# Altium schematic sheet LT8316.SchDoc: LT8316
size A4; Author: Gurubaani; Organization: Waterloop; Address1: 200 University Ave W; Address2: Engineering 5, 1104; Address3: Waterloo, ON; Address4: N2L 3G1; Revision: C; SheetNumber: 3; SheetTotal: 4
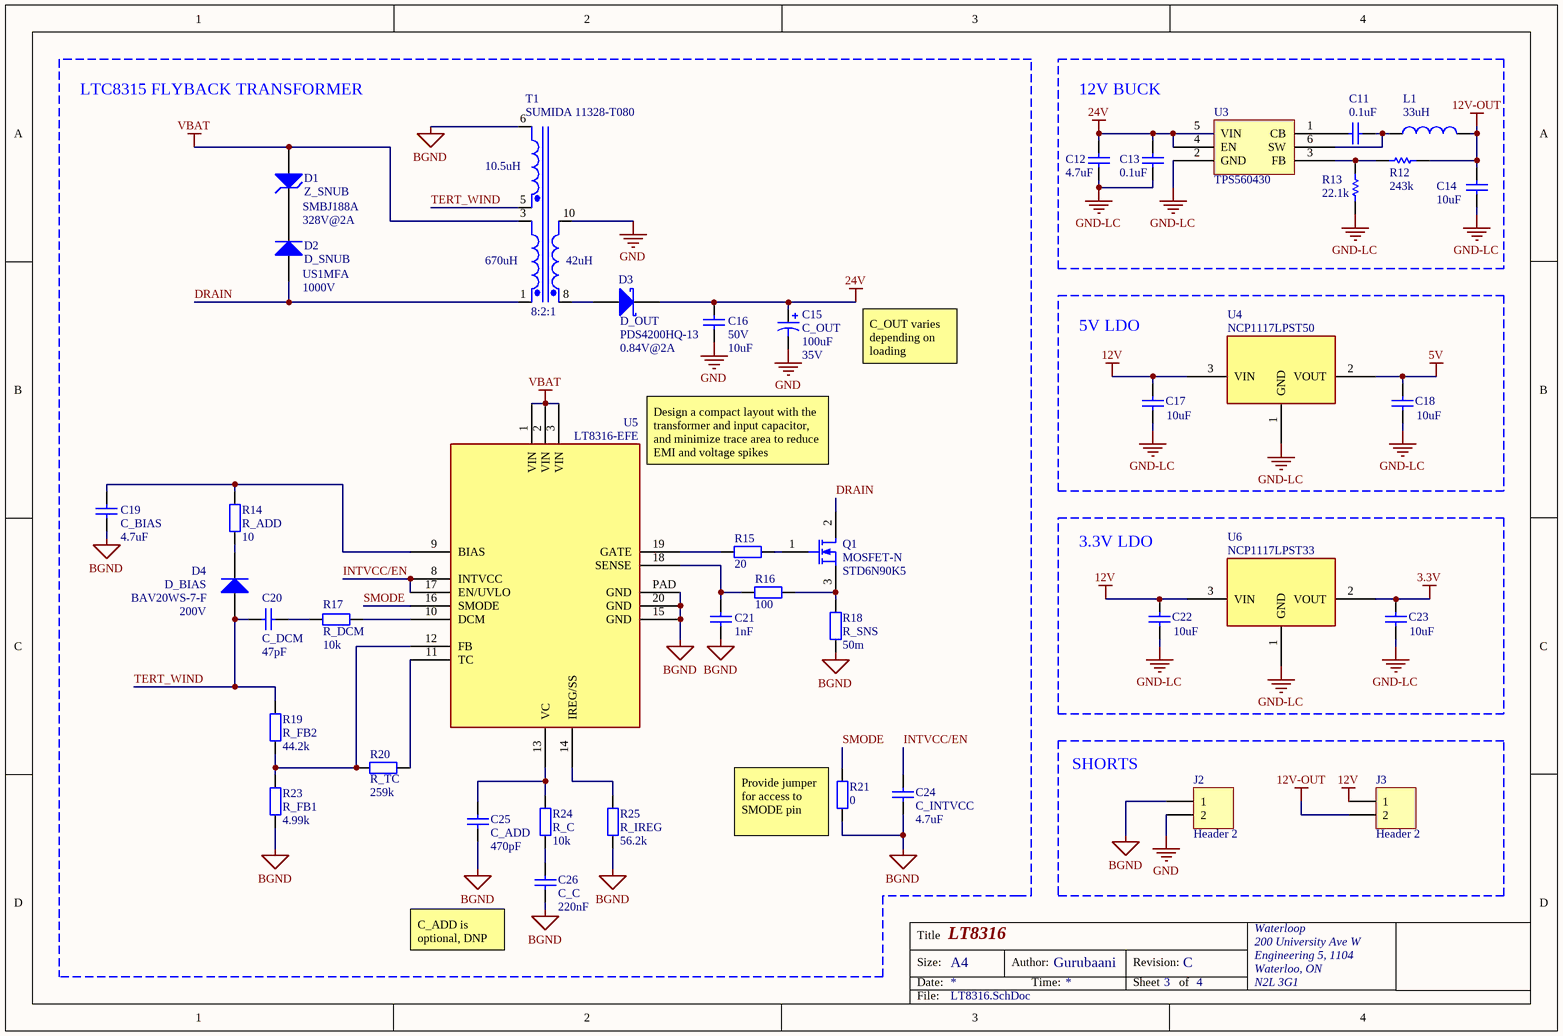
[diagram p0: LT8316.SchDoc]

## Parts
C11  value 0.1uF  [C0805]  (hidden comment: C_OUT)
C12  value 4.7uF  [C0805]  (hidden comment: C_OUT)
C13  value 0.1uF  [C0805]  (hidden comment: C_OUT)
C14  value 10uF  [C0805]  (hidden comment: C_OUT)
C15  C_OUT  value 100uF  Voltage: 35V  [RB7.6-15]
C16  value 10uF  Voltage: 50V  [C0805]  (hidden comment: C_OUT)
C17  value 10uF  [C0805]  (hidden comment: C_OUT)
C18  value 10uF  [C0805]  (hidden comment: C_OUT)
C19  C_BIAS  value 4.7uF  [C0805]
C20  C_DCM  value 47pF  [C0805]
C21  value 1nF  [C0805]  (hidden comment: C_OUT)
C22  value 10uF  [C0805]  (hidden comment: C_OUT)
C23  value 10uF  [C0805]  (hidden comment: C_OUT)
C24  C_INTVCC  value 4.7uF  [C0805]
C25  C_ADD  value 470pF  [C0805]
C26  C_C  value 220nF  [C0805]
D1  Z_SNUB  Reverse Voltage: 328V@2A  PartNumber: SMBJ188A  [DO-214AA, SMB]
D2  D_SNUB  Reverse Voltage: 1000V  PartNumber: US1MFA  [SOD-123FL]
D3  D_OUT  Forward Voltage: 0.84V@2A  PartNumber: PDS4200HQ-13  [POWERDI5 (DPAK184P650X115-3N)]
D4  D_BIAS  Reverse Voltage: 200V  PartNumber: BAV20WS-7-F  [SOD323]
J2  Header 2  [HDR1X2]
J3  Header 2  [HDR1X2]
L1  value 33uH  [INDC4532]  (hidden comment: Inductor)
Q1  MOSFET-N  Part Number: STD6N90K5  [DPAK (228P972X240-3N)]
R12  value 243k  [J1-0603]  (hidden comment: Res1)
R13  value 22.1k  [J1-0603]  (hidden comment: Res1)
R14  R_ADD  value 10  [J1-0603]
R15  value 20  [J1-0603]  (hidden comment: R_SNS)
R16  value 100  [J1-0603]  (hidden comment: R_SNS)
R17  R_DCM  value 10k  [J1-0603]
R18  R_SNS  value 50m  [J1-0603]
R19  R_FB2  value 44.2k  [J1-0603]
R20  R_TC  value 259k  [J1-0603]
R21  value 0  [J1-0603]  (hidden comment: R_C)
R23  R_FB1  value 4.99k  [J1-0603]
R24  R_C  value 10k  [J1-0603]
R25  R_IREG  value 56.2k  [J1-0603]
T1  8:2:1  Part Number: SUMIDA 11328-T080  Primary Inductance: 670uH  Secondary Inductance: 42uH  Tertiary Inducatance: 10.5uH  [PQ2620]
U3  TPS560430  [SOT23-6_N]
U4  NCP1117LPST50  [NCP1117LPST]
U5  LT8316-EFE  [LTC8315/8316]
U6  NCP1117LPST33  [NCP1117LPST]

## Blocks framed on the sheet
LTC8315 FLYBACK TRANSFORMER: C15 C16 C19-C21 C24-C26 D1-D4 Q1 R14-R21 R23-R25 T1 U5
12V BUCK: C11-C14 L1 R12 R13 U3
5V LDO: C17 C18 U4
3.3V LDO: C22 C23 U6
SHORTS: J2 J3

## Nets
3.3V: C23.2 U6.2(VOUT)
5V: C18.2 U4.2(VOUT)
12V: C17.2 C22.2 J3.1 U4.3(VIN) U6.3(VIN)
12V-OUT: C14.2 J3.2 L1.2 R12.1
24V: C12.2 C13.2 C15.1 C16.2 D3.2(K) U3.4(EN) U3.5(VIN)
BGND: C19.1 C21.1 C24.2 C25.1 C26.1 J2.1 R18.2 R21.1 R23.1 R25.1 T1.6(Sec2-) U5.15(GND) U5.20(GND) U5.PAD(GND)
GND: C15.2 C16.1 J2.2 T1.10(Pri-)
GND-LC: C12.1 C13.1 C14.1 C17.1 C18.1 C22.1 C23.1 R13.1 U3.2(GND) U4.1(GND) U6.1(GND)
VBAT: D1.1(A) T1.3(Sec1-) U5.1(VIN) U5.2(VIN) U5.3(VIN)
DRAIN: D2.1(A) Q1.2(D) T1.1(Sec1+)
INTVCC/EN: C24.1 U5.8(INTVCC) U5.17(EN/UVLO)
SMODE: R21.2 U5.16(SMODE)
TERT_WIND: C20.1 D4.1(A) R19.2 T1.5(Sec2+)
NetC11_1: C11.1 L1.1 U3.6(SW)
NetC11_2: C11.2 U3.1(CB)
NetC19_2: C19.2 R14.1 U5.9(BIAS)
NetC20_2: C20.2 R17.2
NetC21_2: C21.2 R16.1 U5.18(SENSE)
NetC25_2: C25.2 R24.2 U5.13(VC)
NetC26_2: C26.2 R24.1
NetD1_2: D1.2(K) D2.2(K)
NetD3_1: D3.1(A) T1.8(Pri+)
NetD4_2: D4.2(K) R14.2
NetQ1_1: Q1.1(G) R15.2
NetQ1_3: Q1.3(S) R16.2 R18.1
NetR12_2: R12.2 R13.2 U3.3(FB)
NetR15_1: R15.1 U5.19(GATE)
NetR17_1: R17.1 U5.10(DCM)
NetR19_1: R19.1 R20.2 R23.2 U5.12(FB)
NetR20_1: R20.1 U5.11(TC)
NetR25_2: R25.2 U5.14(IREG/SS)

## Notes on the sheet
- C_OUT varies depending on loading
- (near U5) Design a compact layout with the transformer and input capacitor, and minimize trace area to reduce EMI and voltage spikes
- (near R21) Provide jumper for access to SMODE pin
- (near C26) C_ADD is optional, DNP
- Title
- Size:
- Date:
- A4
- Author:
- Time:
- Revision:
- Sheet
- of
- File:

## Library data of the parts
C11-C14 C16-C26 = Cap: Capacitor; Published: 8-Jun-2000; LatestRevisionDate: 17-Jul-2002; LatestRevisionNote: Re-released for DXP Platform.; PackageReference: RAD-0.3; Publisher: Altium Limited; PackageDescription: Radial Cap, Thru-Hole; 2 Leads; 0.3 in Pin Spacing
C15 = Cap Pol1: Polarized Capacitor (Radial); Published: 8-Jun-2000; LatestRevisionDate: 17-Jul-2002; LatestRevisionNote: Re-released for DXP Platform.; PackageReference: RB7.6-15; Publisher: Altium Limited; PackageDescription: Polarized Capacitor (Radial); 2 Leads
D1 = D Zener: Zener Diode
D2 D4 = Diode: Default Diode
D3 = D Schottky: Schottky Diode
J2 J3 = Header 2: Header, 2-Pin; LatestRevisionDate: 17-Jul-2002; LatestRevisionNote: Re-released for DXP Platform.; Publisher: Altium Limited
L1 = Inductor: Code_IEC: 1005; Published: 8-Jun-2000; LatestRevisionDate: 29-May-2009; LatestRevisionNote: IPC-7351 Footprint Added.; PackageReference: 0402-A; Publisher: Altium Limited; PackageDescription: Chip Inductor; Code_JEITA: 0402
Q1 = MOSFET-N: N-Channel MOSFET; Published: 8-Jun-2000; LatestRevisionDate: 17-Jul-2002; LatestRevisionNote: Re-released for DXP Platform.; PackageVersion: 1995/1996; PackageReference: E3; Publisher: Altium Limited; PackageDescription: TO, Flat Index; 3 In-Line, Axial Leads; Body Dia. 4.6mm; Lead Dia. 0.5 mm (max)
R12 R13 = Res1: Resistor; Published: 8-Jun-2000; LatestRevisionDate: 17-Jul-2002; LatestRevisionNote: Re-released for DXP Platform.; PackageReference: AXIAL-0.3; Publisher: Altium Limited; PackageDescription: Axial Device, Thru-Hole; 2 Leads; 0.3 in Pin Spacing
R14-R21 R23-R25 = Res2: Resistor; Published: 8-Jun-2000; LatestRevisionDate: 17-Jul-2002; LatestRevisionNote: Re-released for DXP Platform.; PackageReference: AXIAL-0.4; Publisher: Altium Limited; PackageDescription: Axial Device, Thru-Hole; 2 Leads; 0.4 in Pin Spacing
T1 = Trans3: Three-winding Transformer (Non-Ideal); Published: 25-Jan-2001; LatestRevisionDate: 17-Jul-2002; LatestRevisionNote: Re-released for DXP Platform.
U3 = TPS560430: IC REG BUCK PFM 600MA SOT23-6
U4 = NCP1117LPST50: IC REG LINEAR 5V 1A SOT223
U5 = LT8316-EFE: 600VIN MICROPOWER, ISOLATED NO-O
U6 = NCP1117LPST33: IC REG LINEAR 3.3V 1A SOT223